# Altium schematic sheet nguon.SchDoc: <Project Name>
size A4; ENG_APP_DATE: --/--/--; DSN_APP_DATE: --/--/--; CHK_APP_DATE: --/--/--; Engineer: Engineer; Address4: Thành phố Hồ Chí Minh; DocumentNumber: 1; Revision: 1.0; SheetNumber: 1; SheetTotal: 1
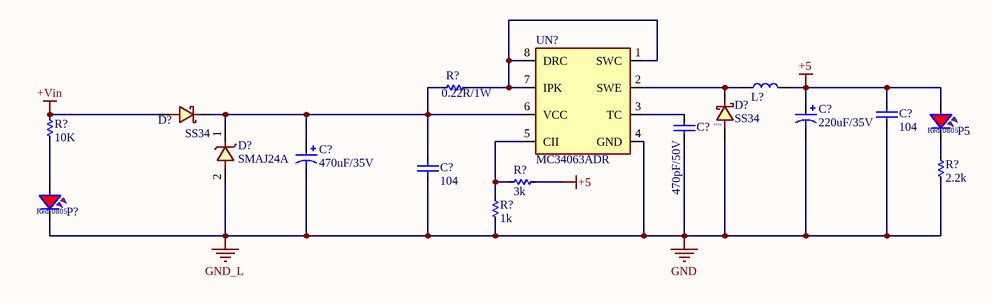
[diagram p0: nguon.SchDoc]

## Parts
(Parts that share a designator on the sheet are numbered #1, #2 ... from top to bottom, then left to right.)
C?#1  220uF/35V  [C8X12mm]
C?#2  104  [C_0805_SMD]
C?#3  470pF/50V  [C_0805_SMD]
C?#4  470uF/35V  [C10mm]
C?#5  104  [C_0805_SMD]
D?#1  SS34  [D_SMA]
D?#2  SS34  [D_SMA]
D?#3  SMAJ24A  [DO_241AC_SMA_MFG]
L?  220uH  [CDRH74]  (value not drawn)
P5  LED RED  [LED 0805 Red]  (value not drawn)
P?  LED RED  [LED 0805 Red]  (value not drawn)
R?#1  0.22R/1W  [RES 2512 1W]
R?#2  10K  [RES-SMD-0805]
R?#3  2.2k  [RES-SMD-0805]
R?#4  3k  [RES-SMD-0805]
R?#5  1k  [RES-SMD-0805]
UN?  MC34063ADR  [SO_8]

## Nets
+5: C?#1.1 C?#2.1 L?.2 P5.1 R?#4.1
+Vin: D?#1.1(A) R?#2.1
GND: C?#1.2 C?#2.2 C?#3.1 C?#4.2 C?#5.1 D?#2.1(A) D?#3.2 P?.2 R?#3.2 R?#5.2 UN?.4(GND)  [also labelled GND_L]
NetC?#3_2: C?#3.2 UN?.3(TC)
NetC?#4_1: C?#4.1 C?#5.2 D?#1.2(K) D?#3.1 R?#1.2 UN?.6(VCC)
NetD?#2_2: D?#2.2(K) L?.1 UN?.2(SWE)
NetP5_2: P5.2 R?#3.1
NetP?_1: P?.1 R?#2.2
NetR?#1_1: R?#1.1 UN?.1(SWC) UN?.7(IPK) UN?.8(DRC)
NetR?#4_2: R?#4.2 R?#5.1 UN?.5(CII)

## Notes on the sheet
- Title
- Size:
- Date:
- A4
- Number:
- Time:
- Revision:
- Sheet
- of
- File:
- (in symbol LED 0805 RED) Red; 0805

## Library data of the parts
C?#1 = Cap Pol 220uF/35V: Polarized Capacitor (Axial) 220uF 35V; Code: 1402-228
C?#2 C?#5 = Cap 0805 104 100nF: Cap SMD 0805 104-100nF-0.1uF 50V; Code: 1438-080
C?#3 = Cap 0805 470pF 50V: Cap SMD 0805  470pF 50V; Code: 1438-056
C?#4 = Cap Pol 470uF/35V: Polarized Capacitor (Axial) 470uF 35V; Code: 1402-231
D?#1 D?#2 = SS34-SMA: Surface-Mount Schottky Barrier Rectifier; Code: 2005-008
  D?#2: Value: SS34
D?#3 = TVS SMAJ24A-DO241AC: SMAJ Series 400W Surface Mount Uni-Directional TVS Diode - DO-214AC; Designed by: TranLuyen; Code: N/A
L? = CD74 7345-221 220uH: INDUCTOR SMD; Code: 1526-001
P5 P? = LED 0805 RED: LED 0805 SMD RED; Code: 8600-017; Designed by: TranLuyen
R?#1 = Res 0.22R 2512 1W: Resistor SMD 2512 1W; Code: 1032-005
R?#2 = Res 10k 0805: Resistor SMD 0805; Code: 1024-111
R?#3 = Res 2.2K 0805: Resistor SMD 0805; Code: 1024-094
R?#4 = Res 3k 0805: Resistor SMD 0805; Code: 1024-098; Designed by: TranLuyen
R?#5 = Res 1k 0805: Resistor SMD 0805; Code: 1024-086
UN? = MC34063ADR: MC3x063A 1.5-A Peak Boost/Buck/Inverting Switching Regulators; Code: 5015-078; Designed by: TranLuyen; ComponentLink1Description: Datasheet; ComponentLink1URL: http://www.ti.com/lit/ds/symlink/mc33063a.pdf?src-supplier=Digi-Key